# EAGLE design le_table (EAGLE 7.7.0)
SCALE: 1:1; SCHEMATIC_NAME: RECO0.16.018.01.00.00.E3; STUDENT: D. Palamarčuks; THESIS_SUPERVISOR: I. Galkins
Assembly variants: SMD_SENSORS
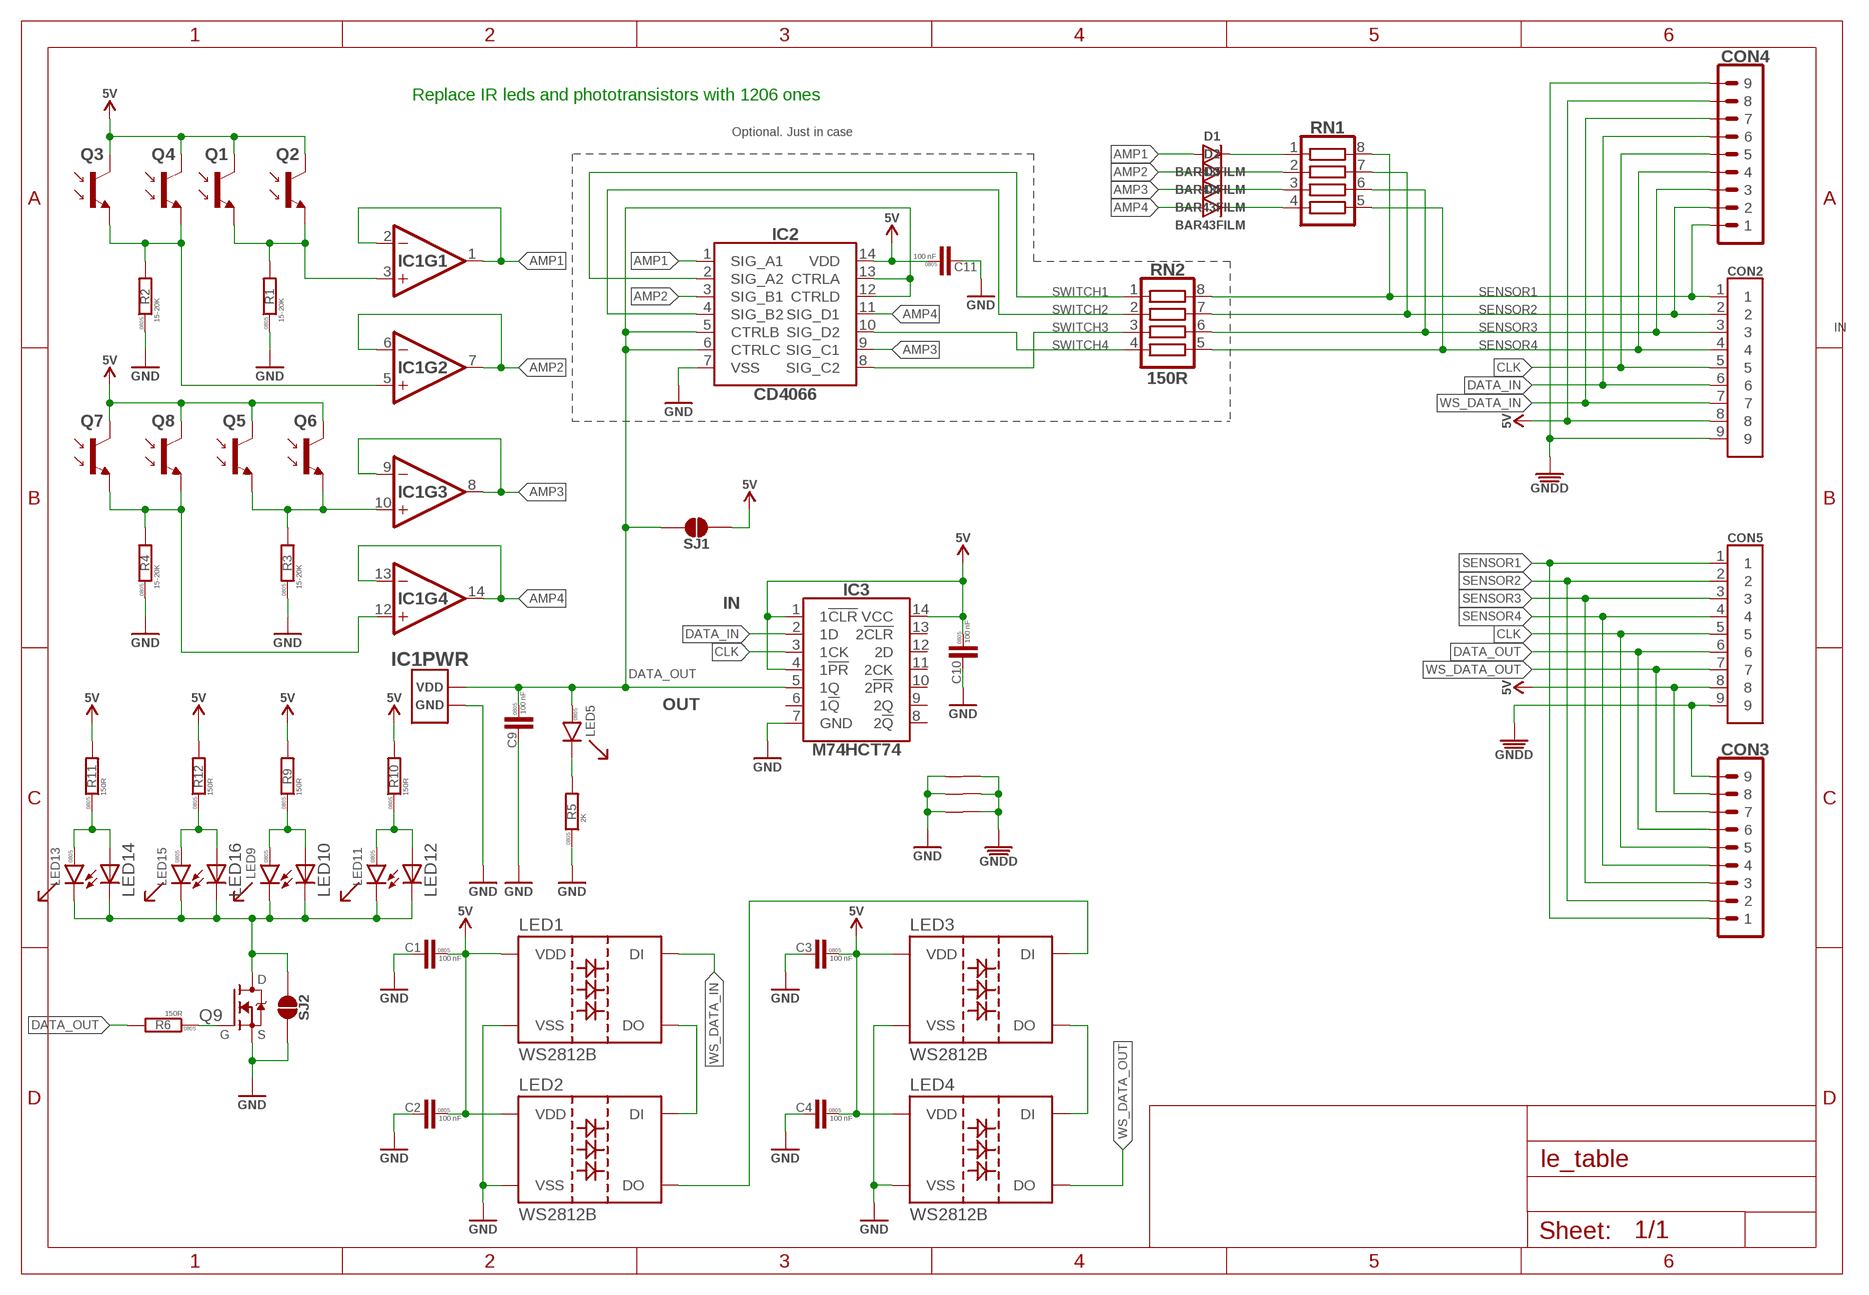
[diagram p0: schematic, sheet 1]

## Parts
C1  100 nF  C-0805  [C0805]
C2  100 nF  C-0805  [C0805]
C3  100 nF  C-0805  [C0805]
C4  100 nF  C-0805  [C0805]
C9  100 nF  C-0805  [C0805]
C10  100 nF  C-0805  [C0805]
C11  100 nF  C-0805  [C0805]
CON2  CONNECTOR  [CONNECTOR]
CON3  PINHEAD_1X09-2  [1X09-PTH_2]
CON4  PINHEAD_1X09-2  [1X09-PTH_2]
CON5  CONNECTOR  [CONNECTOR]
D1  BAR43AFILM  [SOT23-3]  (not fitted in variant SMD_SENSORS)
D2  BAR43AFILM  [SOT23-3]  (not fitted in variant SMD_SENSORS)
D3  BAR43AFILM  [SOT23-3]  (not fitted in variant SMD_SENSORS)
D4  BAR43AFILM  [SOT23-3]  (not fitted in variant SMD_SENSORS)
IC1  LM2902DT  [SO-14]
IC2  CD4066  [SO-14]
IC3  M74HCT74  [SO-14]
LED1  WS2812B  [WS2812B]
LED2  WS2812B  [WS2812B]
LED3  WS2812B  [WS2812B]
LED4  WS2812B  [WS2812B]
LED5  LED-0805  [0805_LED]  (not fitted in variant SMD_SENSORS)
LED9  LED-0805  [0805_LED]
LED10  LED-3MM  [LED-3MM]  (not fitted in variant SMD_SENSORS)
LED11  LED-0805  [0805_LED]
LED12  LED-3MM  [LED-3MM]  (not fitted in variant SMD_SENSORS)
LED13  LED-0805  [0805_LED]
LED14  LED-3MM  [LED-3MM]  (not fitted in variant SMD_SENSORS)
LED15  LED-0805  [0805_LED]
LED16  LED-3MM  [LED-3MM]  (not fitted in variant SMD_SENSORS)
Q1  PHOTOTRANSISTOR-3MM  [LED-3MM]  (not fitted in variant SMD_SENSORS)
Q2  PHOTOTRANSISTOR-0805  [0805]
Q3  PHOTOTRANSISTOR-3MM  [LED-3MM]  (not fitted in variant SMD_SENSORS)
Q4  PHOTOTRANSISTOR-0805  [0805]
Q5  PHOTOTRANSISTOR-3MM  [LED-3MM]  (not fitted in variant SMD_SENSORS)
Q6  PHOTOTRANSISTOR-0805  [0805]
Q7  PHOTOTRANSISTOR-3MM  [LED-3MM]  (not fitted in variant SMD_SENSORS)
Q8  PHOTOTRANSISTOR-0805  [0805]
Q9  IRLML2502-SOT23  [SOT23B-3]
R1  15-20K  R-0805  [R0805]
R2  15-20K  R-0805  [R0805]
R3  15-20K  R-0805  [R0805]
R4  15-20K  R-0805  [R0805]
R5  2K  R-0805  [R0805]  (not fitted in variant SMD_SENSORS)
R6  150R  R-0805  [R0805]
R9  150R  R-0805  [R0805]
R10  150R  R-0805  [R0805]
R11  150R  R-0805  [R0805]
R12  150R  R-0805  [R0805]
RN1  RESISTOR_ARRAY  [CAT16-J4]  (not fitted in variant SMD_SENSORS)
RN2  150R  RESISTOR_ARRAY  [CAT16-J4]
SJ1  SOLDER_JOINT  [RES_0]
SJ2  SOLDER_JOINT  [RES_0]
U$3  CONNECTION  [CONNECTION]
U$6  CONNECTION  [CONNECTION]
U$7  CONNECTION  [CONNECTION]

## Nets
AMP1: D1.1(A) IC1.1(OUT) IC1.2(-IN) IC2.1(SIG_A1)
AMP2: D2.1(A) IC1.6(-IN) IC1.7(OUT) IC2.3(SIG_B1)
AMP3: D3.1(A) IC1.8(OUT) IC1.9(-IN) IC2.9(SIG_C1)
AMP4: D4.1(A) IC1.13(-IN) IC1.14(OUT) IC2.11(SIG_D1)
CLK: CON2.5 CON3.5 CON4.5 CON5.5 IC3.3(1CK)
DATA_IN: CON2.6 CON4.6 IC3.2(1D)
DATA_OUT: C9.1 CON3.6 CON5.6 IC1.4(PWR:VDD) IC2.5(CTRLB) IC2.6(CTRLC) IC2.12(CTRLD) IC2.13(CTRLA) IC3.5(1Q) LED5.A R6.2 SJ1.2
GND: C1.2 C2.2 C3.2 C4.2 C9.2 C10.2 C11.2 IC1.11(PWR:GND) IC2.7(VSS) IC3.7(GND) LED1.3(VSS) LED2.3(VSS) LED3.3(VSS) LED4.3(VSS) Q9.2(S) R1.1 R2.1 R3.1 R4.1 R5.1 SJ2.2 U$3.P$2 U$6.P$2 U$7.P$2
GNDD: CON2.9 CON3.9 CON4.9 CON5.9 U$3.P$1 U$6.P$1 U$7.P$1
N$1: Q9.1(G) R6.1
N$3: LED5.C R5.2
N$4: LED1.2(DO) LED2.4(DI)
N$6: LED2.2(DO) LED3.4(DI)
N$7: LED3.2(DO) LED4.4(DI)
N$9: LED11.A LED12.A R10.1
N$10: LED13.A LED14.A R11.1
N$11: LED9.A LED10.A R9.1
N$13: LED15.A LED16.A R12.1
N$16: D1.3(C) RN1.1
N$17: D2.3(C) RN1.2
N$18: D3.3(C) RN1.3
N$21: D4.3(C) RN1.4
N$23: LED9.C LED10.K(C) LED11.C LED12.K(C) LED13.C LED14.K(C) LED15.C LED16.K(C) Q9.3(D) SJ2.1
SENS1: IC1.3(+IN) Q1.K(E) Q2.2(E) R1.2
SENS2: IC1.5(+IN) Q3.K(E) Q4.2(E) R2.2
SENS3: IC1.10(+IN) Q5.K(E) Q6.2(E) R3.2
SENS4: IC1.12(+IN) Q7.K(E) Q8.2(E) R4.2
SENSOR1: CON2.1 CON3.1 CON4.1 CON5.1 RN1.8 RN2.8
SENSOR2: CON2.2 CON3.2 CON4.2 CON5.2 RN1.7 RN2.7
SENSOR3: CON2.3 CON3.3 CON4.3 CON5.3 RN1.6 RN2.6
SENSOR4: CON2.4 CON3.4 CON4.4 CON5.4 RN1.5 RN2.5
SWITCH1: IC2.2(SIG_A2) RN2.1
SWITCH2: IC2.4(SIG_B2) RN2.2
SWITCH3: IC2.8(SIG_C2) RN2.3
SWITCH4: IC2.10(SIG_D2) RN2.4
VDD_5V: C1.1 C2.1 C3.1 C4.1 C10.1 C11.1 CON2.8 CON3.8 CON4.8 CON5.8 IC2.14(VDD) IC3.1(1!CLR) IC3.4(1!PR) IC3.14(VCC) LED1.1(VDD) LED2.1(VDD) LED3.1(VDD) LED4.1(VDD) Q1.A(C) Q2.1(C) Q3.A(C) Q4.1(C) Q5.A(C) Q6.1(C) Q7.A(C) Q8.1(C) R9.2 R10.2 R11.2 R12.2 SJ1.1 ; supply symbol labelled 5V
WS_DATA_IN: CON2.7 CON4.7 LED1.4(DI)
WS_DATA_OUT: CON3.7 CON5.7 LED4.2(DO)
Unconnected: IC3.6(1!Q) IC3.8(2!Q) IC3.9(2Q) IC3.10(2!PR) IC3.11(2CK) IC3.12(2D) IC3.13(2!CLR)

## Notes on the sheet
- Replace IR leds and phototransistors with 1206 ones
- Optional. Just in case
- IN
- IN
- OUT

## Library data of the parts
C1-C4 C9-C11 = rc:C; FARNELL#: 2496834; PACKAGE: 0805; TME#: GRM188R71H104KA93D
CON2 CON5 = pixel_masterlib:CONNECTOR; BOM: EXCLUDE
CON3 CON4 = pinhead:PINHEAD_1X09; BOM: EXCLUDE
D1-D4 = pixel_masterlib:BAR43AFILM; ASSY: DNM; LINK: https://www.chipdip.ru/product/bar43film; MANF: ST Microelectronics; MANF#: BAR43FILM
IC1 = pixel_masterlib:LM2902DT; LINK: https://www.chipdip.ru/product/lm2902dt-2
IC2 = pixel_masterlib:CD4066; LINK: https://www.chipdip.ru/product/cd4066bm
IC3 = pixel_masterlib:M74HCT74; LINK: https://www.chipdip.ru/product/m74hct74rm1
LED1-LED4 = WS2812:WS2812B
LED5 LED9 LED11 LED13 LED15 = FreeHands_master_lib:LED; PACKAGE: 0805
LED10 LED12 LED14 LED16 = dp_devices:LED: Light Emitting Diode; ASSEMBLY: SPECIAL; BOM: OPTIONAL; COLOR: BLUE; LINK: http://www.zip-2002.ru/osveshchenie_i_indikatsiya/svetodiody/86349/1x3x4_red_50_mcd_2,1v/
Q1-Q8 = FreeHands_master_lib:PHOTOTRANSISTOR
Q9 = watchdog_master_library:IRLML2502: MOSFET N-CH 20V 4.2A SOT-23; DIGIKEY#: IRLML2502PBFTR-ND; MANF: Infineon Technologies; MANF#: IRLML2502TRPBF
R1-R6 R9-R12 = rc:R; PACKAGE: 0805
RN1 = pixel_masterlib:RESISTOR_ARRAY: Chip Resistor Array 4 Single Resistor; ASSY: DNM
RN2 = pixel_masterlib:RESISTOR_ARRAY: Chip Resistor Array 4 Single Resistor
SJ1 SJ2 = DAS_mater_library:SOLDER_JOINT
U$3 U$6 U$7 = usb2can_master_lib:CONNECTION; BOM: EXCLUDE

## Net classes
4 USBpair: width 0.152 mm, drill 0.305 mm, clearance 0.152 mm

## Board
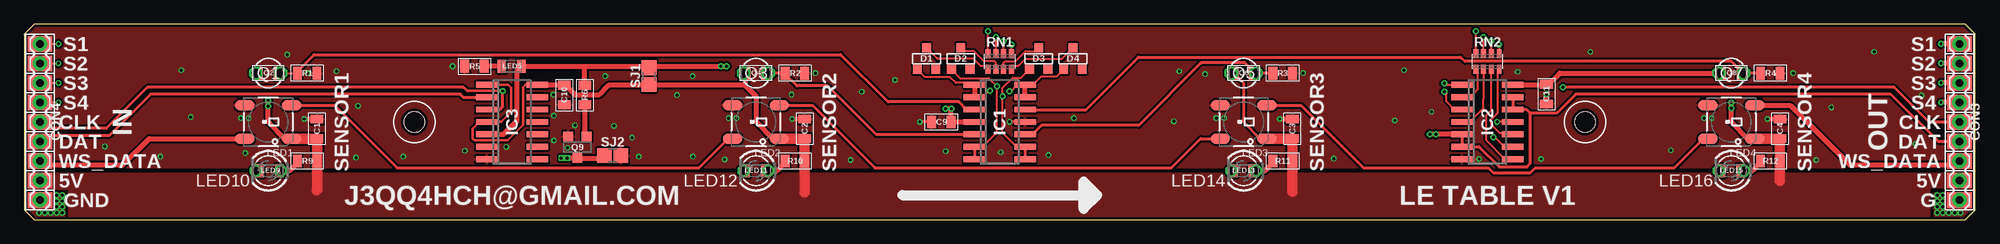
[diagram p1: board, top side]
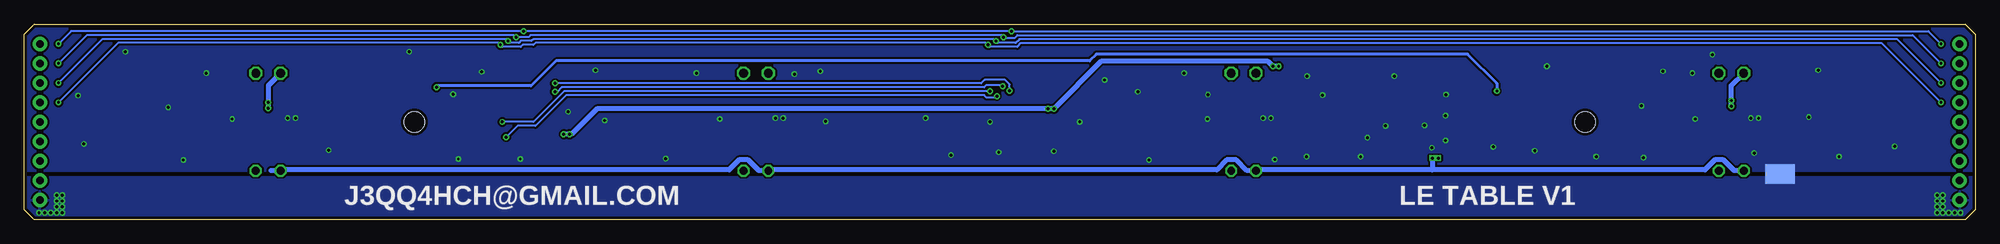
[diagram p2: board, bottom side, seen from below]

Size 200 x 20 mm. Coordinates in mm from the lower left corner, seen from the top.
Outline: 0,19 0,1 1,0 199,0 200,1 200,19 199,20 1,20 0,19
Copper layers (1*16): Top 0.035mm / dielectric 0.5mm / Bottom 0.035mm
Design rules "design_rules *": minimum track width 0.2mm, minimum drill 0.2mm, track to track 0.2mm, track to pad 0.2mm, pad to pad 0.2mm, via to via 0.2mm, smd to smd 0.15mm, copper to edge 0.3mm, drill to drill 0.3mm, minimum pad ring 0.125mm, minimum via ring 0.125mm, stop-mask expansion 1mil, vias tented up to drill 0.31mm, thermal gap 8mil

### Footprints (pad centres in the part's own frame; a part is rotated, then mirrored left to right if it is on the bottom)
C0805 = smd 0.9 x 1.3: 1 -1,0; 2 1,0
CONNECTOR = smd 1.6 x 2.5: 1 -8,0; 2 -6,0; 3 -4,0; 4 -2,0; 5 0,0; 6 2,0; 7 4,0; 8 6,0; 9 8,0
1X09-PTH_2 = drill 0.8 pad 1.5: 1 -8,0; 2 -6,0; 3 -4,0; 4 -2,0; 5 0,0; 6 2,0; 7 4,0; 8 6,0; 9 8,0
SOT23-3 = smd 0.9 x 0.9: 1 -0.95,-1.1; 2 0.95,-1.1; 3 0,1.1
SO-14 = smd 2.2 x 0.6: 1 -2.6,3.81; 2 -2.6,2.54; 3 -2.6,1.27; 4 -2.6,0; 5 -2.6,-1.27; 6 -2.6,-2.54; 7 -2.6,-3.81; 8 2.6,-3.81; 9 2.6,-2.54; 10 2.6,-1.27; 11 2.6,0; 12 2.6,1.27; 13 2.6,2.54; 14 2.6,3.81
WS2812B = smd 2 x 1.1: 1 -2.4,1.7; 2 -2.4,-1.7; 3 2.4,-1.7; 4 2.4,1.7
0805_LED = smd 0.9 x 1.3: A -0.953,0; C 1.048,0
LED-3MM = drill 0.813 octagon: A -1.27,0; K 1.27,0
LED-3MM' = drill 0.9 octagon: A -1.27,0; K 1.27,0
0805 = smd 0.9 x 1.3: 1 -1,0; 2 1,0
SOT23B-3 = smd 1 x 1: 1 -0.95,-1.1; 2 0.95,-1.1; 3 0,1.1
R0805 = smd 0.9 x 1.3: 1 -1,0; 2 1,0
CAT16-J4 = smd 0.5 x 0.9: 1 -1.2,-0.8; 2 -0.4,-0.8; 3 0.4,-0.8; 4 1.2,-0.8; 5 1.2,0.8; 6 0.4,0.8; 7 -0.4,0.8; 8 -1.2,0.8
RES_0 = smd 1.5 x 1.5: 1 -0.85,0; 2 0.85,0
MOUNTING_HOLE_M2 = hole 2.1: 0,0
CONNECTION = smd 1 x 1: P$1 -0.5,0; P$2 0.5,0

### Placement (x,y rotation side)
C1  30,9.3 90 top
C2  80,9.3 90 top
C3  130,9.3 90 top
C4  180,9.3 90 top
C9  94,10 180 top
C10  55.35,12.75 270 top
C11  156.05,12.85 270 top
CON2  1.6,10 270 top
CON3  198.4,10 270 top
CON4  1.6,10 270 top
CON5  198.41,10 270 top
D1  92.5,16.5 0 top  (not fitted)
D2  96,16.5 0 top  (not fitted)
D3  104,16.5 0 top  (not fitted)
D4  107.5,16.5 0 top  (not fitted)
IC1  100,10 0 top
IC2  150,10 0 top
IC3  50,10 0 top
LED1  25,10 180 top
LED2  75,10 180 top
LED3  125,10 180 top
LED4  175,10 180 top
LED5  50,15.7 180 top  (not fitted)
LED9  25.2,5 180 top
LED10  25,5 180 top  (not fitted)
LED11  75,5 180 top
LED12  75,5 180 top  (not fitted)
LED13  125,5 180 top
LED14  125,5 180 top  (not fitted)
LED15  175,5 180 top
LED16  175,5 180 top  (not fitted)
Q1  PHOTOTRANSISTOR-3MM  [LED-3MM']  25,15 0 top  (not fitted)
Q2  25,15 0 top
Q3  PHOTOTRANSISTOR-3MM  [LED-3MM']  75,15 0 top  (not fitted)
Q4  75,15 0 top
Q5  PHOTOTRANSISTOR-3MM  [LED-3MM']  125,15 0 top  (not fitted)
Q6  125,15 0 top
Q7  PHOTOTRANSISTOR-3MM  [LED-3MM']  175,15 0 top  (not fitted)
Q8  175,15 0 top
Q9  56.7,7.4 180 top
R1  29,15 180 top
R2  79,15 180 top
R3  129,15 180 top
R4  179,15 180 top
R5  46.15,15.7 0 top  (not fitted)
R6  57.45,12.75 90 top
R9  29,6 0 top
R10  79,6 0 top
R11  129,6 0 top
R12  179,6 0 top
RN1  100,16.2 0 top  (not fitted)
RN2  150,16.2 0 top
SJ1  64.05,14.7 90 top
SJ2  60.3,6.55 0 top
U$1  [MOUNTING_HOLE_M2]  160,10 0 top
U$3  21,4.67 90 bottom
U$4  [MOUNTING_HOLE_M2]  40,10 0 top
U$6  20,4.67 90 bottom
U$7  19,4.67 90 bottom

### Tracks (layer width: path | path; a pad name or v marks a point on that pad's centre or on a via)
AMP1  (via drill 0.3 pad 0.6)
  Top 0.2: 98.11,13.81 IC1.1 97.21,14 95.5,14 94.9,14.6 92.35,14.6 D1.1 | IC1.2 98.24,12.54 98.89,13.19 v99,13.19 | v145.6,13.95 145.74,13.81 IC2.1
  Top 0.5: IC1.1 IC1.2
  Bottom 0.2: v99,13.19 99,13.85 99.45,14.3 101.55,14.3 101.9,13.95 v145.6,13.95
AMP2  (via drill 0.3 pad 0.6)
  Top 0.2: IC1.6 98.21,7.46 99.7,8.95 v99.7,13.65 98.85,14.5 95.95,14.5 D2.1 | IC2.3 146.63,11.27 145.8,12.1 145.8,12.9 v145.6,13.1
  Top 0.3: IC1.6 IC1.7
  Bottom 0.2: v99.7,13.65 99.85,13.8 101.35,13.8 101.6,13.55 144.9,13.55 145.35,13.1 v145.6,13.1
AMP3  (via drill 0.3 pad 0.6)
  Top 0.2: IC1.9 101.74,7.46 100.3,8.9 v100.3,12.65 100.3,13.5 101.35,14.55 102.2,14.55 D3.1 | IC2.9 151.74,7.46 150.75,8.45 v150.6,8.45
  Top 0.3: IC1.9 IC1.8
  Bottom 0.2: v100.3,12.65 100.45,12.5 101.35,12.5 101.6,12.75 144.45,12.75 147.6,9.6 149.45,9.6 v150.6,8.45
AMP4  (via drill 0.3 pad 0.6)
  Top 0.2: v101,13.15 101.13,13.15 101.79,13.81 IC1.14 103.21,13.81 103.4,14 103.6,14 104.25,14.65 105.8,14.65 D4.1 | IC2.11 v151,10
  Top 0.5: IC1.13 IC1.14
  Bottom 0.2: v101,13.15 144.65,13.15 147.8,10 v151,10
CLK  (via drill 0.3 pad 0.6)
  Top 0.25: 45.4,13.18 v49.05,13.18
  Top 0.3: v157.75,13.55 191.7,13.55 195.25,10 CON3.5 | IC3.3 48.72,11.27 49.05,11.6 v49.05,13.18 | CON4.5 1.8,10 2.45,9.35 8.4,9.35 12.6,13.55 45.02,13.55 45.4,13.18
  Top 0.5: CON3.5 CON5.5
  Bottom 0.3: v157.75,13.55 157.6,13.7 148.05,13.7 145.5,16.25 90.8,16.25 90.1,16.95 52.05,16.95 49.05,13.95 v49.05,13.18
DATA_IN
  Top 0.3: IC3.2 45,12.55 44.7,12.85 12.95,12.85 8.75,8.65 2.25,8.65 CON4.6
DATA_OUT  (via drill 0.3 pad 0.6)
  Top 0.3: IC2.13 IC2.12 154.03,11.27 154.4,10.9 | IC2.5 IC2.6 149.14,7.46 151.2,5.4 154.05,5.4 154.4,5.75 154.4,10.9 | 154.4,10.9 157.1,10.9 159.05,12.85 191.35,12.85 196.2,8 CON3.6 | SJ1.2 64.2,15.7 v71.4,15.7
  Top 0.5: IC3.5 49.13,8.73 50.5,10.1 50.5,15.25 LED5.A | v94.45,11.35 v95.05,11.35 95,11.3 C9.1 IC1.4 | LED5.A 57.45,15.7 | 57.45,15.7 v71.4,15.7 v72,15.7 | 50.95,15.4 LED5.A | 50.75,15.7 LED5.A | IC2.5 arc90 147.38,8.75 v144.1,8.75 | R6.2 57.45,15.7 | CON3.6 CON5.6
  Bottom 0.5: v71.4,15.7 v72,15.7 72.5,16.2 89.6,16.2 v94.45,11.35 | v94.45,11.35 v95.05,11.35 | v94.45,11.35 141.3,11.35 143.9,8.75 v144.1,8.75 v144.7,8.75
GND  (via drill 0.3, 0.3 pad 0.6)
  Top 0.2: IC2.7 v149.15,6.19 v149.15,6.2
  Top 0.3: C9.2 v91.8,10 | IC1.11 v101,10
  Top 0.5: C4.2 v178.7,10.3 | C3.2 v128.7,10.3 | C2.2 v78.7,10.3 | C1.2 v28.7,10.3 | C11.2 v156.05,12.85
  other vias: 172.2,10.4 173,10.4 122.2,10.4 123,10.4 72.2,10.4 73,10.4 22.2,10.4 23,10.4 29,15 81.1,15 131.1,15 181.35,15 43.9,15.7 155.5,6.2 153.1,15.15 141.45,15.3 121.05,14.9 85.85,13.1 68.5,14.7 59.55,14.7 32,15.2 26.95,16.9 16.1,15.3 8.25,7.5 34,6.35 34.2,11.65 49.4,7.45 54.25,12.8 84.7,6.1 94.45,7 105,6.6 117.85,10.05 134.25,6.25 140.5,10.15 144.25,11.05 168.8,7.1 183.7,6.1 193.9,7.75 185.25,11.5 194.5,12.7 189.65,17.2 160.55,17.2 78.65,12.8 100.1,6.9 71.8,6.15 89.25,14.3 107.6,10.4 118.4,15.2 17.05,10.5 54.3,10.65 54.3,8.1 56.45,9.65 55.7,7.35 63,6.45 62.3,8.4 60.45,9.6 66.9,12.75 68.55,6.45 13.95,6.45 22.65,6.8 45.15,7.05 38.85,6.45
  pour Bottom: 0,20 0,5 200,5 200,20
  pour Top (rank 5): 0,20 200,20 200,5.3 0,5.3
GNDD  (via drill 0.3 pad 0.6)
  other vias: 1.5,0.7 2.1,0.7 2.7,0.7 3.3,0.7 3.3,1.3 3.3,1.9 3.3,2.5 3.9,2.5 3.9,1.9 3.9,1.3 3.9,0.7 198.5,0.7 197.9,0.7 197.3,0.7 196.1,0.7 196.1,1.3 196.1,1.9 196.1,2.5 196.7,2.5 196.7,1.9 196.7,1.3 196.7,0.7
  pour Bottom: 0.1,4.4 0.1,0 7.65,0 200,0 200,4.4
  pour Top (no thermals): 0.35,0.1 0.35,2.7 4.1,2.7 4.1,0.1
  pour Top (no thermals): 195.85,0.1 195.85,2.7 199.6,2.7 199.6,0.1
N$1
  Top 0.5: R6.1 57.45,8.7 Q9.1
N$3
  Top 0.5: LED5.C R5.2
N$4
  Top 0.3: LED1.2 31.8,11.7 38.2,5.3 69.15,5.3 72.15,8.3 LED2.4
N$6
  Top 0.3: LED2.2 80.8,11.7 87.2,5.3 117.6,5.3 120.6,8.3 LED3.4
N$7
  Top 0.3: LED3.2 130.9,11.7 137.3,5.3 150.1,5.3 150.6,4.8 154.4,4.8 154.9,5.3 169.15,5.3 172.15,8.3 LED4.4 | LED4.4 172.7,8.3 | LED4.4 172.35,8.3
N$9
  Top 0.5: LED11.A LED12.A 77.2,5 78,5.8 R10.1
N$10
  Top 0.5: LED13.A LED14.A 127.2,5 128,5.8 R11.1
N$11
  Top 0.5: LED9.A LED10.A 27.2,5 28,5.8 R9.1
N$13
  Top 0.5: LED15.A LED16.A 177.2,5 178,5.8 R12.1
N$16
  Top 0.2: D1.3 93.62,16.48 93.65,16.5 97.3,16.5 98.05,15.75 98.8,15.75 RN1.1
N$17
  Top 0.2: RN1.2 99.6,16.05 99.45,16.2 98.4,16.2 97.35,17.25 96,17.25 D2.3
N$18
  Top 0.2: RN1.3 100.4,16.05 100.55,16.2 101.6,16.2 102.65,17.25 104,17.25 D3.3
N$21
  Top 0.2: RN1.4 101.2,15.75 101.9,15.75 102.65,16.5 106.4,16.5 D4.3
N$23  (via drill 0.3)
  Top 0.406: LED10.K LED9.C
  Top 0.5: LED11.C LED12.K | LED13.C LED14.K | LED15.C LED16.K | v55.05,6.3 v55.65,6.3 Q9.3 59.45,6.3 SJ2.1
  Bottom 0.5: LED10.K 24.7,5 25.8,6.1 26.7,6.1 27.7,5.1 55.65,5.1 | 55.65,5.1 73.63,5.1 LED12.K 74.65,5 75.75,6.1 76.75,6.1 77.75,5.1 123.63,5.1 LED14.K 124.7,5 125.8,6.1 126.75,6.1 127.75,5.1 173.63,5.1 LED16.K 174.7,5 | v55.05,6.3 v55.65,6.3 55.65,5.1
SENS1
  Top 0.2: Q2.2 Q1.K R1.2
  Top 0.3: R1.2 28,15.2 29.7,16.9 83.7,16.9 88.55,12.05 95.8,12.05 96.58,11.27 IC1.3
SENS2
  Top 0.3: R2.2 Q3.K Q4.2 | R2.2 78,15.2 | IC1.5 87.32,8.73 82.35,13.7 79.2,13.7 78,14.9 R2.2
SENS3
  Top 0.3: R3.2 Q5.K Q6.2 126,15.2 125.15,16.05 120.65,16.05 114.25,9.65 104.3,9.65 103.38,8.73 IC1.10 102.93,8.73
SENS4
  Top 0.3: R4.2 Q7.K Q8.2 176,15.2 175,16.2 147.7,16.2 147.25,16.65 114.2,16.65 108.82,11.27 IC1.12
SENSOR1  (via drill 0.3, 0.3 pad 0.6)
  Top 0.2: RN1.8 v98.8,19.3 | RN2.8 v148.8,19.3 | CON4.1 v3.5,18
  Top 0.3: CON4.1 1.6,17.35
  Top 0.5: v196.5,18 CON3.1 CON5.1
  Bottom 0.2: v196.5,18 195.2,19.3 v148.8,19.3 v98.8,19.3 4.8,19.3 v3.5,18
SENSOR2  (via drill 0.3, 0.3 pad 0.6)
  Top 0.2: RN1.7 v99.6,18.7 | RN2.7 v149.6,18.7 | CON4.2 v3.5,16
  Top 0.5: v196.5,16 CON3.2 CON5.2
  Bottom 0.2: v196.5,16 193.6,18.9 149.8,18.9 v149.6,18.7 148.3,18.7 148.1,18.9 99.8,18.9 v99.6,18.7 99.5,18.6 98.5,18.6 98.2,18.9 6.4,18.9 v3.5,16
SENSOR3  (via drill 0.3, 0.3 pad 0.6)
  Top 0.2: RN1.6 v100.4,18.3 | RN2.6 v150.4,18.3 | CON4.3 v3.5,14
  Top 0.5: v196.5,14 CON3.3 CON5.3
  Bottom 0.2: v196.5,14 192,18.5 150.6,18.5 v150.4,18.3 150.2,18.1 149.3,18.1 149.1,18.3 148,18.3 147.8,18.5 100.6,18.5 v100.4,18.3 100.2,18.1 98.4,18.1 98,18.5 8,18.5 v3.5,14
SENSOR4  (via drill 0.3, 0.3 pad 0.6)
  Top 0.2: 101.2,16.8 RN1.5 v101.2,17.9 | RN2.5 v151.2,17.9 | CON4.4 v3.5,12
  Top 0.5: v196.5,12 CON3.4 CON5.4
  Bottom 0.2: v196.5,12 190.4,18.1 151.4,18.1 v151.2,17.9 151,17.7 149.1,17.7 148.9,17.9 147.8,17.9 147.6,18.1 101.4,18.1 v101.2,17.9 101,17.7 98.2,17.7 97.8,18.1 9.6,18.1 v3.5,12
SWITCH1
  Top 0.2: RN2.1 arc-90 148.95,15.25 148.95,13.3 148.19,12.54 IC2.2
SWITCH2
  Top 0.2: RN2.2 149.6,12.9 149.6,12.4 149.6,11.4 148.2,10 IC2.4
SWITCH3
  Top 0.2: RN2.3 150.4,11.2 149.9,10.7 149.9,8.1 151.81,6.19 IC2.8
SWITCH4
  Top 0.2: 151.05,15.25 RN2.4 151.05,15.4 151.05,10.95 150.4,10.3 150.4,9.7 151.2,8.9 151.6,8.9 arc-19 IC2.10
VDD_5V  (via drill 0.3 pad 0.6)
  Top 0.25: IC3.14 51.38,13.81 51.15,13.57 51.15,9.7 49.55,8.1 46.15,8.1 45.95,8.3 45.95,9.32 46.62,10 IC3.4 48.88,10 49.92,11.05 49.92,13.5 49.62,13.81 IC3.1
  Top 0.3: Q1.A Q2.1 | 26.7,8.3 LED1.1 | Q4.1 Q3.A | Q5.A Q6.1 125,14 125,10 126.7,8.3 LED3.1 | Q7.A Q8.1 | C10.1 | SJ1.1 63.95,13.75
  Top 0.5: IC3.14 55.29,13.81 C10.1 55.5,13.75 56.5,12.75 58.85,12.75 59.85,13.75 63.95,13.75 | LED2.1 76.7,8.3 75,10 75,12.65 73.9,13.75 | Q4.1 73.9,14.9 73.9,13.75 | IC2.14 156.01,13.81 C11.1 156.25,13.85 157.4,15 Q7.A 173.85,14.88 | 26.7,8.3 25,10 v25,11.6 v25,12.2 | LED4.1 176.7,8.3 175,10 v175,11.4 v175,12 | 73.9,13.75 64.15,13.75 SJ1.1
  Top 1.1: LED1.1 C1.1 R9.2 30,3.05 29.95,3 | LED2.1 C2.1 R10.2 80,2.8 | LED3.1 C3.1 R11.2 130,2.85 | LED4.1 C4.1 R12.2 180,3.95
  Bottom 0.5: v25,11.6 25,13.75 24.98,13.75 Q1.A | Q7.A 175,13.73 v175,11.4
  pour Top (rank 5, no thermals): 0.45,3.2 4.6,3.2 4.6,0 195.3,0 195.3,3.35 199.55,3.35 199.55,4.65 0.45,4.65
WS_DATA_IN
  Top 0.5: LED1.4 12.8,8.3 10.05,5.55 1.6,5.55 CON4.7
WS_DATA_OUT
  Top 0.5: LED4.2 181.05,11.7 187.15,5.6 198.4,5.6 CON3.7 CON5.7

### Text on the board
tPlace: S1 | S1 | S2 | S2 | S3 | S3 | S4 | S4 | CLK | IN | SENSOR1 | SENSOR2 | SENSOR3 | SENSOR4 | OUT | CLK | DAT | DAT | WS_DATA | WS_DATA | 5V | 5V | GND | J3QQ4HCH@GMAIL.COM | LE TABLE V1 | G
bPlace: LE TABLE V1 | J3QQ4HCH@GMAIL.COM